# Altium project Stabilizer_Pounder.PrjPCB (part 2 of 3)

## Sheet Quad_DDS.SchDoc: Pounder
size 420 x 297 mm; Author: G.Kasprowicz; CompanyName: WUT ISE; DrawnBy: G.Kasprowicz; Organization: WUT ISE; Address1: PW ISE; Address2: Nowowiejska 15/19 00-665 Warsaw; Address3: gkasprow@gmail.com; DocumentNumber: 4; Revision: 2; SheetNumber: 4; SheetTotal: 7; ModifiedBy: -; CheckedDate: -; Title2: Quad DDS & clocking; DivGrp: WUT ISE; Designer: G.Kasprowicz; ModifiedDate: -; ProjectName: Sensor Box
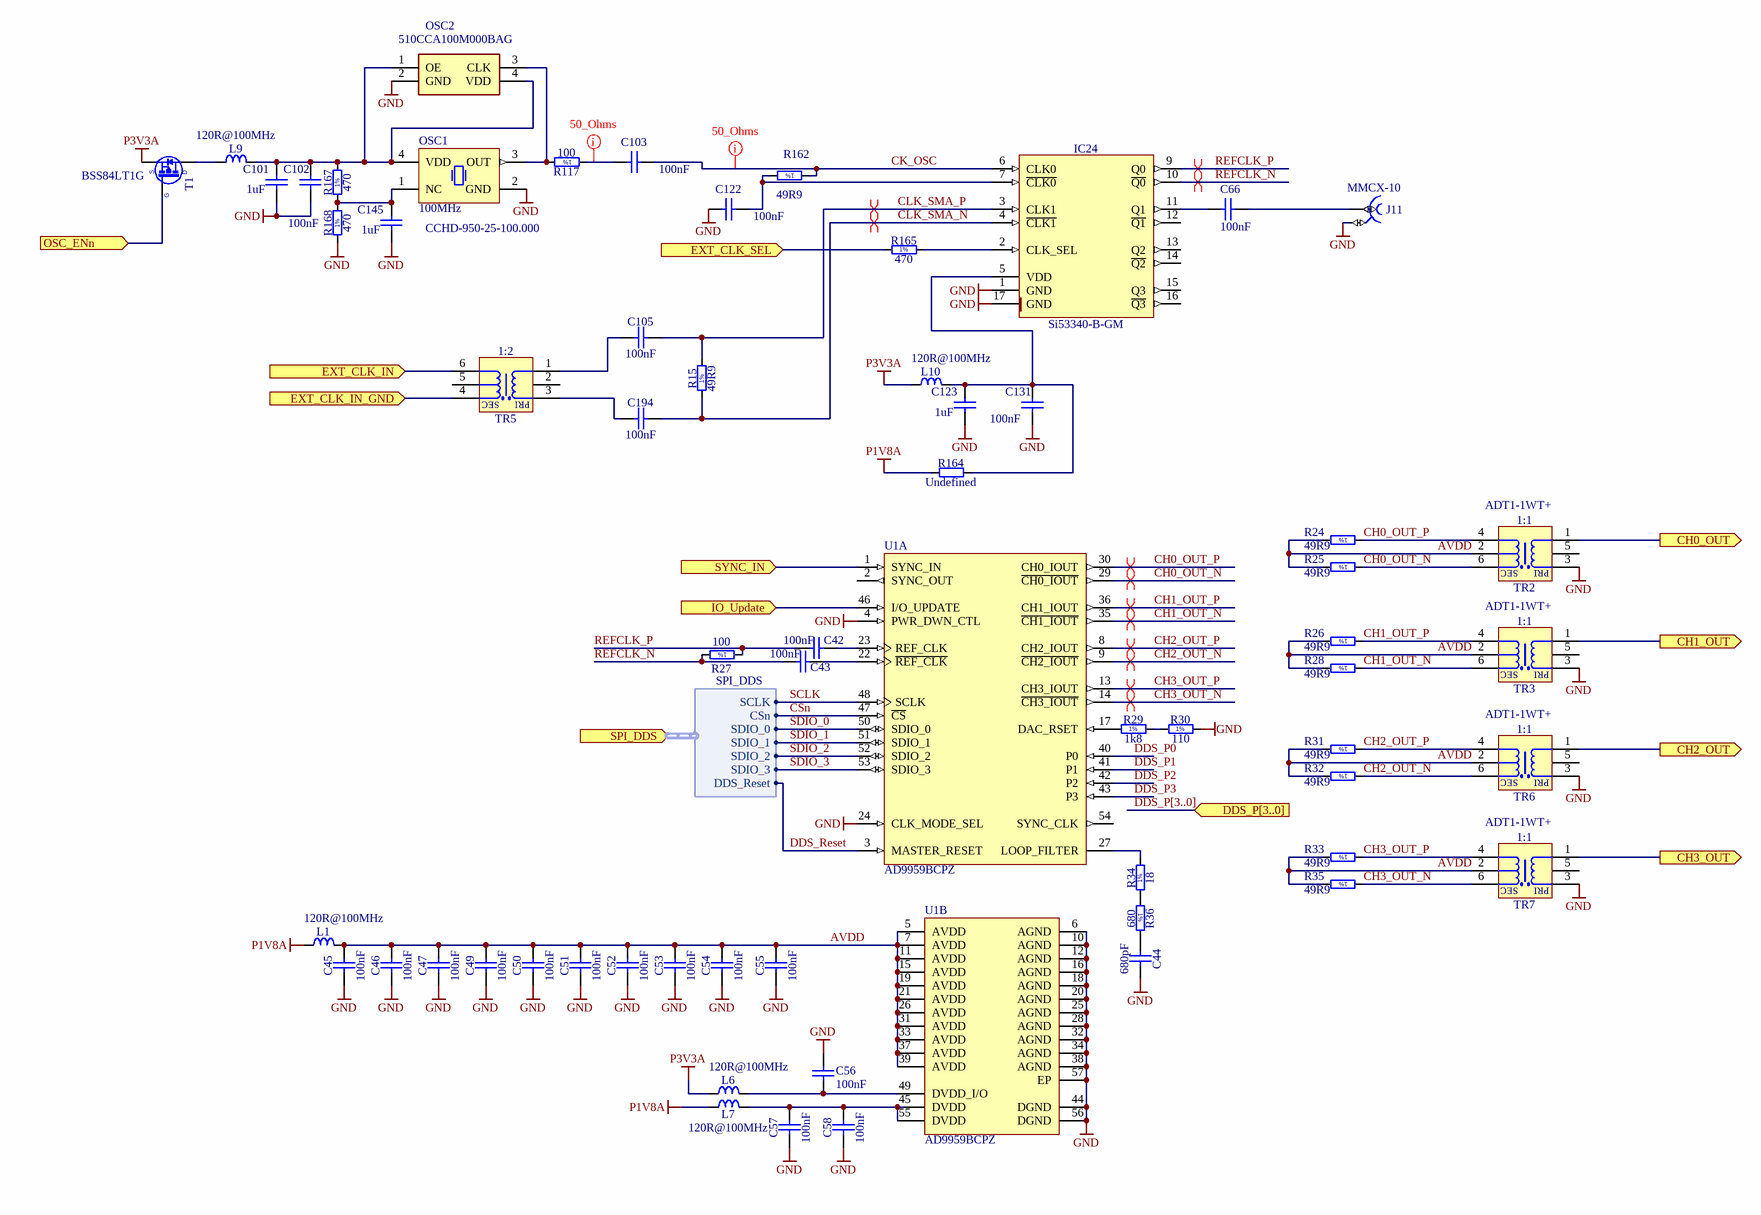
[diagram p3: Quad_DDS.SchDoc]

### Parts
C42  100nF  [CAPC1005X55N]
C43  100nF  [CAPC1005X55N]
C44  680pF  [CAPC1608X87N]
C45  100nF  [CAPC1005X55N]
C46  100nF  [CAPC1005X55N]
C47  100nF  [CAPC1005X55N]
C49  100nF  [CAPC1005X55N]
C50  100nF  [CAPC1005X55N]
C51  100nF  [CAPC1005X55N]
C52  100nF  [CAPC1005X55N]
C53  100nF  [CAPC1005X55N]
C54  100nF  [CAPC1005X55N]
C55  100nF  [CAPC1005X55N]
C56  100nF  [CAPC1005X55N]
C57  100nF  [CAPC1005X55N]
C58  100nF  [CAPC1005X55N]
C66  100nF  [CAPC1005X55N]
C101  1uF  [CAPC1005X55N]
C102  100nF  [CAPC1005X55N]
C103  100nF  [CAPC1005X55N]
C105  100nF  [CAPC1005X55N]
C122  100nF  [CAPC1005X55N]
C123  1uF  [CAPC1005X55N]
C131  100nF  [CAPC1005X55N]
C145  1uF  [CAPC1005X55N]
C194  100nF  [CAPC1005X55N]
IC24  Si53340-B-GM  [QFN50P300X300X90-17N-S175]
J11  Part Number: MMCX-10  [NINIGI_MMCX-10]  (hidden comment: Coax_1Female_1Shield)
L1  120R@100MHz  [INDC1608X95N]
L6  120R@100MHz  [INDC1608X95N]
L7  120R@100MHz  [INDC1608X95N]
L9  120R@100MHz  [INDC1608X95N]
L10  120R@100MHz  [INDC1608X95N]
OSC1  100MHz  Manufacturer Part Number: CCHD-950-25-100.000  [OSC_CRYSTEK_CCHD-950]
OSC2  510CCA100M000BAG  [510CBA49M1520BAG]
R15  49R9  [RESC1005X40N]
R24  49R9  [RESC1005X40N]
R25  49R9  [RESC1005X40N]
R26  49R9  [RESC1005X40N]
R27  100  [RESC1005X40N]
R28  49R9  [RESC1005X40N]
R29  1k8  [RESC1608X55N]
R30  110  [RESC1005X40N]
R31  49R9  [RESC1005X40N]
R32  49R9  [RESC1005X40N]
R33  49R9  [RESC1005X40N]
R34  18  [RESC1005X40N]
R35  49R9  [RESC1005X40N]
R36  680  [RESC1005X40N]
R117  100  [RESC1005X40N]
R162  49R9  [RESC1005X40N]
R164  Undefined  [RESC1608X55N]
R165  470  [RESC1005X40N]
R167  470  [RESC1005X40N]
R168  470  [RESC1005X40N]
T1  BSS84LT1G  [SOT95P240X110-3N]
TR2  1:1  Manufacturer Part Number: ADT1-1WT+  [XFMR_MINI-CIRCUITS_CD542]
TR3  1:1  Manufacturer Part Number: ADT1-1WT+  [XFMR_MINI-CIRCUITS_CD542]
TR5  1:2  [XFMR_MINI-CIRCUITS_CD542]
TR6  1:1  Manufacturer Part Number: ADT1-1WT+  [XFMR_MINI-CIRCUITS_CD542]
TR7  1:1  Manufacturer Part Number: ADT1-1WT+  [XFMR_MINI-CIRCUITS_CD542]
U1  AD9959BCPZ  [ADI-CP-56-1_M]  (parts A,B of 2)

### Ports
CH0_OUT (out), CH1_OUT (out), CH2_OUT (out), CH3_OUT (out), DDS_P[3..0] (in), EXT_CLK_IN (in), EXT_CLK_IN_GND (in), EXT_CLK_SEL (in), IO_Update (in), OSC_ENn (in), SPI_DDS (in, harness SPI_DDS), SYNC_IN (in)

### Harnesses
SPI_DDS: SCLK, CSn, SDIO_0, SDIO_1, SDIO_2, SDIO_3, DDS_Reset

### Nets
GND: C44.2 C45.1 C46.1 C47.1 C49.1 C50.1 C51.1 C52.1 C53.1 C54.1 C55.1 C56.1 C57.1 C58.1 C101.1 C102.1 C122.2 C123.1 C131.1 C145.1 IC24.1(GND) IC24.17(GND) J11.2 OSC1.2(GND) OSC2.2(GND) R30.2 R168.1 TR2.3(PDOT) TR3.3(PDOT) TR6.3(PDOT) TR7.3(PDOT) U1.4(PWR_DWN_CTL) U1.6(AGND) U1.10(AGND) U1.12(AGND) U1.16(AGND) U1.18(AGND) U1.20(AGND) U1.24(CLK_MODE_SEL) U1.25(AGND) U1.28(AGND) U1.32(AGND) U1.34(AGND) U1.38(AGND) U1.44(DGND) U1.56(DGND) U1.57(EP)
P1V8A: L1.2 L7.2 R164.1
P3V3A: L6.2 L10.2 T1.2(S)
AVDD: C45.2 C46.2 C47.2 C49.2 C50.2 C51.2 C52.2 C53.2 C54.2 C55.2 L1.1 R24.2 R25.2 R26.2 R28.2 R31.2 R32.2 R33.2 R35.2 TR2.2(SCT) TR3.2(SCT) TR6.2(SCT) TR7.2(SCT) U1.5(AVDD) U1.7(AVDD) U1.11(AVDD) U1.15(AVDD) U1.19(AVDD) U1.21(AVDD) U1.26(AVDD) U1.31(AVDD) U1.33(AVDD) U1.37(AVDD) U1.39(AVDD)
CH0_OUT_N: R25.1 TR2.6(SDOT) U1.29(~{CH0_IOUT})
CH0_OUT_P: R24.1 TR2.4(S) U1.30(CH0_IOUT)
CH1_OUT_N: R28.1 TR3.6(SDOT) U1.35(~{CH1_IOUT})
CH1_OUT_P: R26.1 TR3.4(S) U1.36(CH1_IOUT)
CH2_OUT_N: R32.1 TR6.6(SDOT) U1.9(~{CH2_IOUT})
CH2_OUT_P: R31.1 TR6.4(S) U1.8(CH2_IOUT)
CH3_OUT_N: R35.1 TR7.6(SDOT) U1.14(~{CH3_IOUT})
CH3_OUT_P: R33.1 TR7.4(S) U1.13(CH3_IOUT)
CK_OSC: C103.1 IC24.6(CLK0) R162.1
CLK_SMA_N: C194.2 IC24.4(~{CLK1}) R15.1
CLK_SMA_P: C105.2 IC24.3(CLK1) R15.2
CSn: U1.47(~{CS}) ; port SPI_DDS.CSn
DDS_P0: U1.40(P0)
DDS_P1: U1.41(P1)
DDS_P2: U1.42(P2)
DDS_P3: U1.43(P3)
DDS_Reset: U1.3(MASTER_RESET) ; port SPI_DDS.DDS_Reset
EXT_CLK_SEL: R165.1 ; port EXT_CLK_SEL
IO_Update: U1.46(I/O_UPDATE) ; port IO_Update
OSC_ENn: T1.1(G) ; port OSC_ENn
REFCLK_N: C43.2 IC24.10(~{Q0}) R27.2
REFCLK_P: C42.2 IC24.9(Q0) R27.1
SCLK: U1.48(SCLK) ; port SPI_DDS.SCLK
SDIO_0: U1.50(SDIO_0) ; port SPI_DDS.SDIO_0
SDIO_1: U1.51(SDIO_1) ; port SPI_DDS.SDIO_1
SDIO_2: U1.52(SDIO_2) ; port SPI_DDS.SDIO_2
SDIO_3: U1.53(SDIO_3) ; port SPI_DDS.SDIO_3
SYNC_IN: U1.1(SYNC_IN) ; port SYNC_IN
NetC42_1: C42.1 U1.23(REF_CLK)
NetC43_1: C43.1 U1.22(~{REF_CLK})
NetC44_1: C44.1 R36.2
NetC56_2: C56.2 L6.1 U1.49(DVDD_I/O)
NetC57_2: C57.2 C58.2 L7.1 U1.45(DVDD) U1.55(DVDD)
NetC66_1: C66.1 J11.1
NetC66_2: C66.2 IC24.11(Q1)
NetC101_2: C101.2 C102.2 L9.1 OSC1.4(VDD) OSC2.1(OE) OSC2.4(VDD) R167.2
NetC103_2: C103.2 R117.1
NetC105_1: C105.1 TR5.1(P)
NetC122_1: C122.1 IC24.7(~{CLK0}) R162.2
NetC123_2: C123.2 C131.2 IC24.5(VDD) L10.1 R164.2
NetC145_2: C145.2 OSC1.1(NC) R167.1 R168.2
NetC194_1: C194.1 TR5.3(PDOT)
NetFL2A_1: TR2.1(P) ; port CH0_OUT
NetFL2B_1: TR3.1(P) ; port CH1_OUT
NetFL4A_1: TR6.1(P) ; port CH2_OUT
NetFL4B_1: TR7.1(P) ; port CH3_OUT
NetIC24_2: IC24.2(CLK_SEL) R165.2
NetJ3_1: TR5.6(SDOT) ; port EXT_CLK_IN
NetJ3_2: TR5.4(S) ; port EXT_CLK_IN_GND
NetL9_2: L9.2 T1.3(D)
NetOSC1_3: OSC1.3(OUT) OSC2.3(CLK) R117.2
NetR29_1: R29.1 U1.17(DAC_RSET)
NetR29_2: R29.2 R30.1
NetR34_1: R34.1 R36.1
NetR34_2: R34.2 U1.27(LOOP_FILTER)

Not connected (* = marked no-connect by the designer): IC24 12(~{Q1}) 13(Q2) 14(~{Q2}) 15(Q3) 16(~{Q3}); TR2 5(NC); TR3 5(NC); TR5 2(NC) 5(SCT); TR6 5(NC); TR7 5(NC); U1 2(SYNC_OUT) 54(SYNC_CLK)

### Buses and harness runs
bus DDS_P[3..0] = port DDS_P[3..0]

### Layout directives
net class 50_Ohms: CK_OSC, NetC103_2
differential pair: CH0_OUT_N, CH0_OUT_P, CH1_OUT_N, CH1_OUT_P, CH2_OUT_N, CH2_OUT_P, CH3_OUT_N, CH3_OUT_P, CLK_SMA_N, CLK_SMA_P, REFCLK_N, REFCLK_P

### Notes on the sheet
- Project/Equipment
- Document
- Designer
- Drawn by
- Check.by
- Copyright WUT ISE 2018.
  This documentation describes Open Hardware and is licensed under the CERN OHL v.1.1. You may redistribute and modify this documentation under the terms of the CERN OHL v.1.1. (http://ohwr.org/CERNOHL). This documentation is distributed WITHOUT ANY EXPRESS OR IMPLIED WARRANTY, INCLUDING OF MERCHANTABILITY, SATISFACTORY QUALITY AND FITNESS FOR A PARTICULAR PURPOSE. Please see the CERN OHL v.1.1 for applicable conditions.
- Contact
- File
- Last Mod.
- Print Date
- Sheet
- Size
- A3
- of
- Rev
- (in symbol R0402_18R_1%_0.0625W_100PPM) 1%
- (in symbol R0402_49R9_1%_0.0625W_100PPM) 1%
- (in symbol R0402_100R_1%_0.0625W_100PPM) 1%
- (in symbol R0402_110R_1%_0.0625W_100PPM) 1%
- (in symbol R0402_470R_1%_0.0625W_100PPM) 1%
- (in symbol R0402_680R_1%_0.0625W_100PPM) 1%
- (in symbol R0603_1K8_1%_0.1W_100PPM) 1%
- (in symbol XFMR_MINI-CIRCUITS_ADT1-1WT+) SEC; PRI
- (in symbol XFMR_MINI-CIRCUITS_ADT2-1T-1P+) SEC; PRI

### Library data of the parts
C42 C43 C45-C47 C49-C58 C66 C102 C103 C105 C122 C131 C194 = CC0402_100NF_16V_10%_X5R: Non-polarised capacitor; Part Description: SMD Multilayer Chip Ceramic Capacitor; Manufacturer: GENERIC; Manufacturer1 Part Number: GRM155R61C104KA88D; Voltage: 16V; TC: X5R; Tolerance: ±10%; Part Number: CC0402_100NF_16V_10%_X5R; Component Kind: Standard; Component Type: Standard; Pin Count: 2; Value: 100nF; Status: None; Manufacturer Part Number: CC0402_100NF_16V_10%_X5R; Case: 0402; Mounted: Yes; Socket: No; SMD: Yes; Sense: No; Manufacturer1 Example: MURATA; Manufacturer1 ComponentHeight: 0.55mm; HelpURL: \\cern.ch\dfs\Applications\Altium\Datasheets\CC0402_X5R_MURATA_GRM.pdf; Author: CERN DEM JLC; CreateDate: 10.12.2013; LatestRevisionDate: 10.12.2013
C44 = CC0603_680PF_50V_5%_NP0: Non-polarised capacitor; Part Description: SMD Multilayer Chip Ceramic Capacitor; Manufacturer: GENERIC; Manufacturer1 Part Number: 223886715681; Voltage: 50V; TC: C0G/NP0; Tolerance: ±5%; Part Number: CC0603_680PF_50V_5%_NP0; Component Kind: Standard; Component Type: Standard; Pin Count: 2; Value: 680pF; Status: Preferred; Manufacturer Part Number: CC0603_680PF_50V_5%_NP0; Case: 0603; Mounted: Yes; Socket: No; SMD: Yes; Sense: No; Manufacturer1 Example: PHYCOMP; Manufacturer1 ComponentHeight: 0.87mm; HelpURL: \\cern.ch\dfs\Applications\Altium\Datasheets\CC0603_NP0_PHYCOMP.pdf; Author: CERN DEM JLC; CreateDate: 03.12.2007; LatestRevisionDate: 03.12.2007
C101 C123 C145 = CC0402_1UF_16V_10%_X5R: Non-polarised capacitor; Part Description: SMD Multilayer Chip Ceramic Capacitor; Manufacturer: GENERIC; Manufacturer1 Part Number: C1005X5R1C105KT; Voltage: 16V; TC: X5R; Tolerance: ±10%; Part Number: CC0402_1UF_16V_10%_X5R; Component Kind: Standard; Component Type: Standard; Pin Count: 2; Value: 1uF; Status: Preferred; Manufacturer Part Number: CC0402_1UF_16V_10%_X5R; Case: 0402; Mounted: Yes; Socket: No; SMD: Yes; Sense: No; Manufacturer1 Example: TDK; Manufacturer1 ComponentHeight: 0.55mm; HelpURL: \\cern.ch\dfs\Applications\Altium\Datasheets\CC0402_X5R_TDK_C.pdf; Author: CERN DEM JLC; CreateDate: 2012-10-25; LatestRevisionDate: 2012-10-25
IC24 = Si53340-B-GM: Low-Jitter LVDS Fanout Clock Buffers, 10-Output,  Any-Input, Any-Frequency up to 1250MHz; Manufacturer: SILICON LABS; PressFit: No; Bonding: No; Part Number: Si53340-B-GM; Component Kind: Standard; Component Type: Standard; Device: Si53340-B-GM; PackageDescription: QFN, 0.50mm Pitch, Square; 16 Pin, 3.00mm L X 3.00mm W X 0.90mm H Body (w/thermal tab 1.75mm x 1.75mm), IPC Medium Density; Part Description: Low-Jitter LVDS Fanout Clock Buffers, 10-Output,  Any-Input, Any-Frequency up to 1250MHz; Manufacturer Part Number: Si53340-B-GM; Pin Count: 17; Case: QFN16; Mounted: Yes; Socket: No; SMD: Yes; Sense: No; ComponentHeight: 0.9mm; HelpURL: \\cern.ch\dfs\Applications\Altium\Datasheets\Si53340-B-GM.pdf; Author: CERN DEM MR; CreateDate: 04.09.2017; LatestRevisionDate: 04.09.2017
J11 = CON_RF_MMCX: Part Description: Straight Through-hole 50 Ohm Micro Mini RF Jack, MMCX Series; Manufacturer: NINIGI; Manufacturer Part Number: NINIGI MMCX-10; PressFit: No; Component Kind: Standard; Component Type: Standard; Pin Count: 2; Mounted: Yes; Socket: No; Sense: No; SMD: No; Status: None; ComponentHeight: 4.35mm; HelpURL: \\cern.ch\dfs\Applications\Altium\Datasheets\SAMTEC_MMCX-J-P-H-ST-TH1.pdf; Author: GK; CreateDate: 05.12.2012; LatestRevisionDate: 05.12.2012
L1 L6 L7 L9 L10 = IND0603_MURATA_BLM18PG121SN1D: Inductor; Part Description: SMD EMIFIL Chip Ferrite Bead; Manufacturer: MURATA; Power: 2A; Resistance: 0.05R; Part Number: IND0603_MURATA_BLM18PG121SN1D; Component Kind: Standard; Component Type: Standard; Pin Count: 2; Value: 120R@100MHz; Status: None; Manufacturer Part Number: BLM18PG121SN1D; Case: 0603; Mounted: Yes; Socket: No; SMD: Yes; Sense: No; ComponentHeight: 0.95mm; HelpURL: \\cern.ch\dfs\Applications\Altium\Datasheets\IND0603_MURATA_BLM18P.pdf; Author: CERN DEM BC; CreateDate: 2015-07-27; LatestRevisionDate: 2015-07-27
OSC1 = OSC_CCHD-950: 100MHz low noise oscillator; Part Number: OSC_100MHZ_CRYSTEK_CCHD-950-25-100.000; Part Description: 3.3V, ±25ppm, 0..70°C, CMOS Surface Mount Ultra-Low Noise Oscillator (CCHD-950 Series); Manufacturer: CRYSTEK CRYSTAL; PressFit: No; Bonding: No; Component Kind: Standard; Component Type: Standard; PackageDescription: Oscillator, 5.08mm Pitch; 4 Pin, 14.2mm L X 9.14mm W X 5.3mm H, CCHD-950 Serie; Value: 100MHz; Pin Count: 4; Mounted: Yes; Socket: No; SMD: Yes; Sense: No; ComponentHeight: 5.3mm; HelpURL: \\cern.ch\dfs\Applications\Altium\Datasheets\OSC_CRYSTEK_CVHD-950.pdf; Author: GK; CreateDate: 04.11.2016; LatestRevisionDate: 04.11.2016
OSC2 = 510CCA100M000BAG: Crystal or Oscillator; Manufacturer_Name: Silicon Labs; Datasheet Link: https://www.silabs.com/documents/public/data-sheets/si510-11.pdf; Height: 1mm; Manufacturer_Part_Number: 510CCA100M000BAG; Mouser Part Number: 634-510CCA100M000BAG; Mouser Price/Stock: https://www.mouser.com/Search/Refine.aspx?Keyword=634-510CCA100M000BAG
R15 R24-R26 R28 R31-R33 R35 R162 = R0402_49R9_1%_0.0625W_100PPM: Resistor - 1%; Part Description: General Purpose Thick Film Chip Resistor; Manufacturer: GENERIC; Manufacturer1 Part Number: 232270674999L or RC0402FR-0749R9L; TC: ±100ppm/°C; PressFit: No; Part Number: R0402_49R9_1%_0.0625W_100PPM; Component Kind: Standard; Component Type: Standard; Pin Count: 2; Value: 49R9; Status: Not Recommended; Power: 0.0625W; Tolerance: ±1%; Manufacturer Part Number: R0402_49R9_1%_0.0625W_100PPM; Case: 0402; Mounted: Yes; Sense: No; Socket: No; SMD: Yes; Manufacturer1 Example: YAGEO PHYCOMP; Manufacturer1 ComponentHeight: 0.4mm; HelpURL: \\cern.ch\dfs\Applications\Altium\Datasheets\R0402_Phycomp_RC0402.pdf; Author: CERN DEM JLC; CreateDate: 24.10.2012; LatestRevisionDate: 24.10.2012
R27 R117 = R0402_100R_1%_0.0625W_100PPM: Resistor - 1%; Part Description: General Purpose Thick Film Chip Resistor; Manufacturer: GENERIC; Manufacturer1 Part Number: 232270671001L; TC: ±100ppm/°C; PressFit: No; Part Number: R0402_100R_1%_0.0625W_100PPM; Component Kind: Standard; Component Type: Standard; Pin Count: 2; Value: 100; Status: Not Recommended; Power: 0.0625W; Tolerance: ±1%; Manufacturer Part Number: R0402_100R_1%_0.0625W_100PPM; Case: 0402; Mounted: Yes; Sense: No; Socket: No; SMD: Yes; Manufacturer1 Example: YAGEO PHYCOMP; Manufacturer1 ComponentHeight: 0.4mm; HelpURL: \\cern.ch\dfs\Applications\Altium\Datasheets\R0402_Phycomp_RC0402.pdf; Author: CERN DEM JLC; CreateDate: 03.12.2007; LatestRevisionDate: 17.10.2012
R29 = R0603_1K8_1%_0.1W_100PPM: Resistor - 1%; Part Description: General Purpose Thick Film Chip Resistor; Manufacturer: GENERIC; Manufacturer1 Part Number: NRC06F1801TRF; Power: 0.1W; TC: ±100ppm/°C; PressFit: No; Part Number: R0603_1K8_1%_0.1W_100PPM; Component Kind: Standard; Component Type: Standard; Pin Count: 2; Value: 1k8; Status: Preferred; Tolerance: ±1%; Manufacturer Part Number: R0603_1K8_1%_0.1W_100PPM; Case: 0603; Mounted: Yes; Sense: No; Socket: No; SMD: Yes; Manufacturer1 Example: NIC COMPONENT; Manufacturer1 ComponentHeight: 0.55mm; HelpURL: \\cern.ch\dfs\Applications\Altium\Datasheets\R0603_NIC_NRC.pdf; Author: CERN DEM JLC; CreateDate: 03.12.2007; LatestRevisionDate: 13.03.2008
R30 = R0402_110R_1%_0.0625W_100PPM: Resistor - 1%; Part Description: General Purpose Thick Film Chip Resistor; Manufacturer: GENERIC; Manufacturer1 Part Number: 232270671101L; TC: ±100ppm/°C; PressFit: No; Part Number: R0402_110R_1%_0.0625W_100PPM; Component Kind: Standard; Component Type: Standard; Pin Count: 2; Value: 110; Status: Not Recommended; Power: 0.0625W; Tolerance: ±1%; Manufacturer Part Number: R0402_110R_1%_0.0625W_100PPM; Case: 0402; Mounted: Yes; Sense: No; Socket: No; SMD: Yes; Manufacturer1 Example: YAGEO PHYCOMP; Manufacturer1 ComponentHeight: 0.4mm; HelpURL: \\cern.ch\dfs\Applications\Altium\Datasheets\R0402_Phycomp_RC0402.pdf; Author: CERN DEM JLC; CreateDate: 03.12.2007; LatestRevisionDate: 17.10.2012
R34 = R0402_18R_1%_0.0625W_100PPM: Resistor - 1%; Part Description: General Purpose Thick Film Chip Resistor; Manufacturer: GENERIC; Manufacturer1 Part Number: 232270671809L; TC: ±100ppm/°C; PressFit: No; Part Number: R0402_18R_1%_0.0625W_100PPM; Component Kind: Standard; Component Type: Standard; Pin Count: 2; Value: 18; Status: Not Recommended; Power: 0.0625W; Tolerance: ±1%; Manufacturer Part Number: R0402_18R_1%_0.0625W_100PPM; Case: 0402; Mounted: Yes; Sense: No; Socket: No; SMD: Yes; Manufacturer1 Example: YAGEO PHYCOMP; Manufacturer1 ComponentHeight: 0.4mm; HelpURL: \\cern.ch\dfs\Applications\Altium\Datasheets\R0402_Phycomp_RC0402.pdf; Author: CERN DEM JLC; CreateDate: 03.12.2007; LatestRevisionDate: 17.10.2012
R36 = R0402_680R_1%_0.0625W_100PPM: Resistor - 1%; Part Description: General Purpose Thick Film Chip Resistor; Manufacturer: GENERIC; Manufacturer1 Part Number: 232270676801L; TC: ±100ppm/°C; PressFit: No; Part Number: R0402_680R_1%_0.0625W_100PPM; Component Kind: Standard; Component Type: Standard; Pin Count: 2; Value: 680; Status: Not Recommended; Power: 0.0625W; Tolerance: ±1%; Manufacturer Part Number: R0402_680R_1%_0.0625W_100PPM; Case: 0402; Mounted: Yes; Sense: No; Socket: No; SMD: Yes; Manufacturer1 Example: YAGEO PHYCOMP; Manufacturer1 ComponentHeight: 0.4mm; HelpURL: \\cern.ch\dfs\Applications\Altium\Datasheets\R0402_Phycomp_RC0402.pdf; Author: CERN DEM JLC; CreateDate: 03.12.2007; LatestRevisionDate: 17.10.2012
R164 = R0603_NO-VALUE: Resistor; Part Description: Reserved Footprint For a 0603 (1608) Chip Resistor; PressFit: No; Mounted: No; Part Number: R0603_NO-VALUE; Component Kind: Standard; Component Type: Standard; Pin Count: 2; Value: Undefined; Status: None; Manufacturer: Undefined; Manufacturer Part Number: R0603_NO-VALUE; Case: 0603; Sense: No; Socket: No; SMD: Yes; Manufacturer1 Example: Undefined; Manufacturer1 Part Number: Undefined; Manufacturer1 ComponentHeight: Undefined; HelpURL: Undefined; Author: CERN DEM JLC; CreateDate: 03.12.2007; LatestRevisionDate: 13.03.2008
R165 R167 R168 = R0402_470R_1%_0.0625W_100PPM: Resistor - 1%; Part Description: General Purpose Thick Film Chip Resistor; Manufacturer: GENERIC; Manufacturer1 Part Number: 232270674701L; TC: ±100ppm/°C; PressFit: No; Part Number: R0402_470R_1%_0.0625W_100PPM; Component Kind: Standard; Component Type: Standard; Pin Count: 2; Value: 470; Status: Not Recommended; Power: 0.0625W; Tolerance: ±1%; Manufacturer Part Number: R0402_470R_1%_0.0625W_100PPM; Case: 0402; Mounted: Yes; Sense: No; Socket: No; SMD: Yes; Manufacturer1 Example: YAGEO PHYCOMP; Manufacturer1 ComponentHeight: 0.4mm; HelpURL: \\cern.ch\dfs\Applications\Altium\Datasheets\R0402_Phycomp_RC0402.pdf; Author: CERN DEM JLC; CreateDate: 03.12.2007; LatestRevisionDate: 17.10.2012
T1 = BSS84LT1G: P-CHANNEL MOSFET WITH DIODE; Part Description: 50V 130mA Single P-Channel Power MOSFET; Manufacturer: ON SEMICONDUCTOR; PressFit: No; Bonding: No; Part Number: BSS84LT1G; Component Kind: Standard; Component Type: Standard; Device: BSS84LT1G; PackageDescription: SOT23 3-Leads, Pitch 0.95mm - Body 1.4x3mm, IPC Medium Density; Manufacturer Part Number: BSS84LT1G; Pin Count: 3; Case: SOT23-3; Mounted: Yes; Socket: No; SMD: Yes; Sense: No; ComponentHeight: 1.1mm; HelpURL: \\cern.ch\dfs\Applications\Altium\Datasheets\BSS84LT1G.pdf; Author: CERN DEM JLC; CreateDate: 29.03.2012; LatestRevisionDate: 29.03.2012
TR2 TR3 TR6 TR7 = XFMR_MINI-CIRCUITS_ADT1-1WT+: 75 Ohm 0.4 To 800MHz RF Transformers; Part Description: 75 Ohms 0.4 to 800 MHz RF Transformer; Part Number: XFMR_MINI-CIRCUITS_ADT1-1WT+; Component Kind: Standard; Component Type: Standard; Pin Count: 6; Value: 1:1; Status: None; Manufacturer: MINI-CIRCUITS; Mounted: Yes; Socket: No; Sense: No; SMD: Yes; ComponentHeight: 2.84mm; HelpURL: \\cern.ch\dfs\Applications\Altium\Datasheets\XFMR_MINI-CIRCUITS_ADT1-1WT+.pdf; Author: CERN DEM JLC; CreateDate: 21.09.2011; LatestRevisionDate: 21.09.2011
TR5 = XFMR_MINI-CIRCUITS_ADT2-1T-1P+: 50 Ohms 0.4 To 450MHz RF Transformer; Part Number: XFMR_MINI-CIRCUITS_ADT2-1T+; Manufacturer Part Number: ADT2-1T+; Component Kind: Standard; Component Type: Standard; Pin Count: 6; Value: 1:2; Status: None; Part Description: 50 Ohms 0.4 To 450MHz RF Transformer; Manufacturer: MINI-CIRCUITS; Mounted: Yes; Socket: No; Sense: No; SMD: Yes; ComponentHeight: 2.84mm; HelpURL: \\cern.ch\dfs\Applications\Altium\Datasheets\XFMR_MINI-CIRCUITS_ADT2-1T-1P+.pdf; Author: CERN DEM MR; CreateDate: 06.09.2017; LatestRevisionDate: 06.09.2017
U1 = CMP-0293-00014-1: 4-Channel, 500 MSPS DDS with 10-Bit DACs, Serial, CP-56-1, 260 Tray, Pb-Free; Tuning Word Width (bits): 32bit; Master fclk: 500MHz; Compliance Range (V): 2.3V; FS Iout (mA nom): 10mA; REFCLK Multiplier: Yes; I Supply total (max): 180mA; Resolution (Bits): 10bit; ComponentLink3URL: http://www.analog.com/static/imported-files/packages/32698137492825CP_56_1.pdf; PackageDescription: 56-Lead Lead Frame Chip Scale Package [LFCSP_VQ]; DatasheetVersion: Rev. B; ComponentLink1URL: www.analog.com; PackageVersion: 112805-0; ComponentLink1Description: Manufacturer URL; ComponentLink2Description: Datasheet; Code_JEDEC: MO-220-VLLD-2; ComponentLink2URL: http://www.analog.com/static/imported-files/data_sheets/AD9959.pdf; PackageReference: CP-56-1; I/O Interface: Serial; ComponentLink3Description: Package Specification

## Sheet Digital_Attenuator_Amp.SchDoc: Pounder
size 420 x 297 mm; Author: G.Kasprowicz; CompanyName: WUT ISE; DrawnBy: G.Kasprowicz; Organization: WUT ISE; Address1: PW ISE; Address2: Nowowiejska 15/19 00-665 Warsaw; Address3: gkasprow@gmail.com; DocumentNumber: 3; Revision: 2; SheetNumber: 3; SheetTotal: 7; ModifiedBy: -; CheckedDate: -; Title2: Attenuator & Power amplifier; DivGrp: WUT ISE; Designer: G.Kasprowicz; ModifiedDate: -; ProjectName: Sensor Box
Used 2 times, as channels Digital_Attenuator_Amp, Digital_Attenuator_Amp. Parts and nets are listed once, with the designators drawn on the sheet.
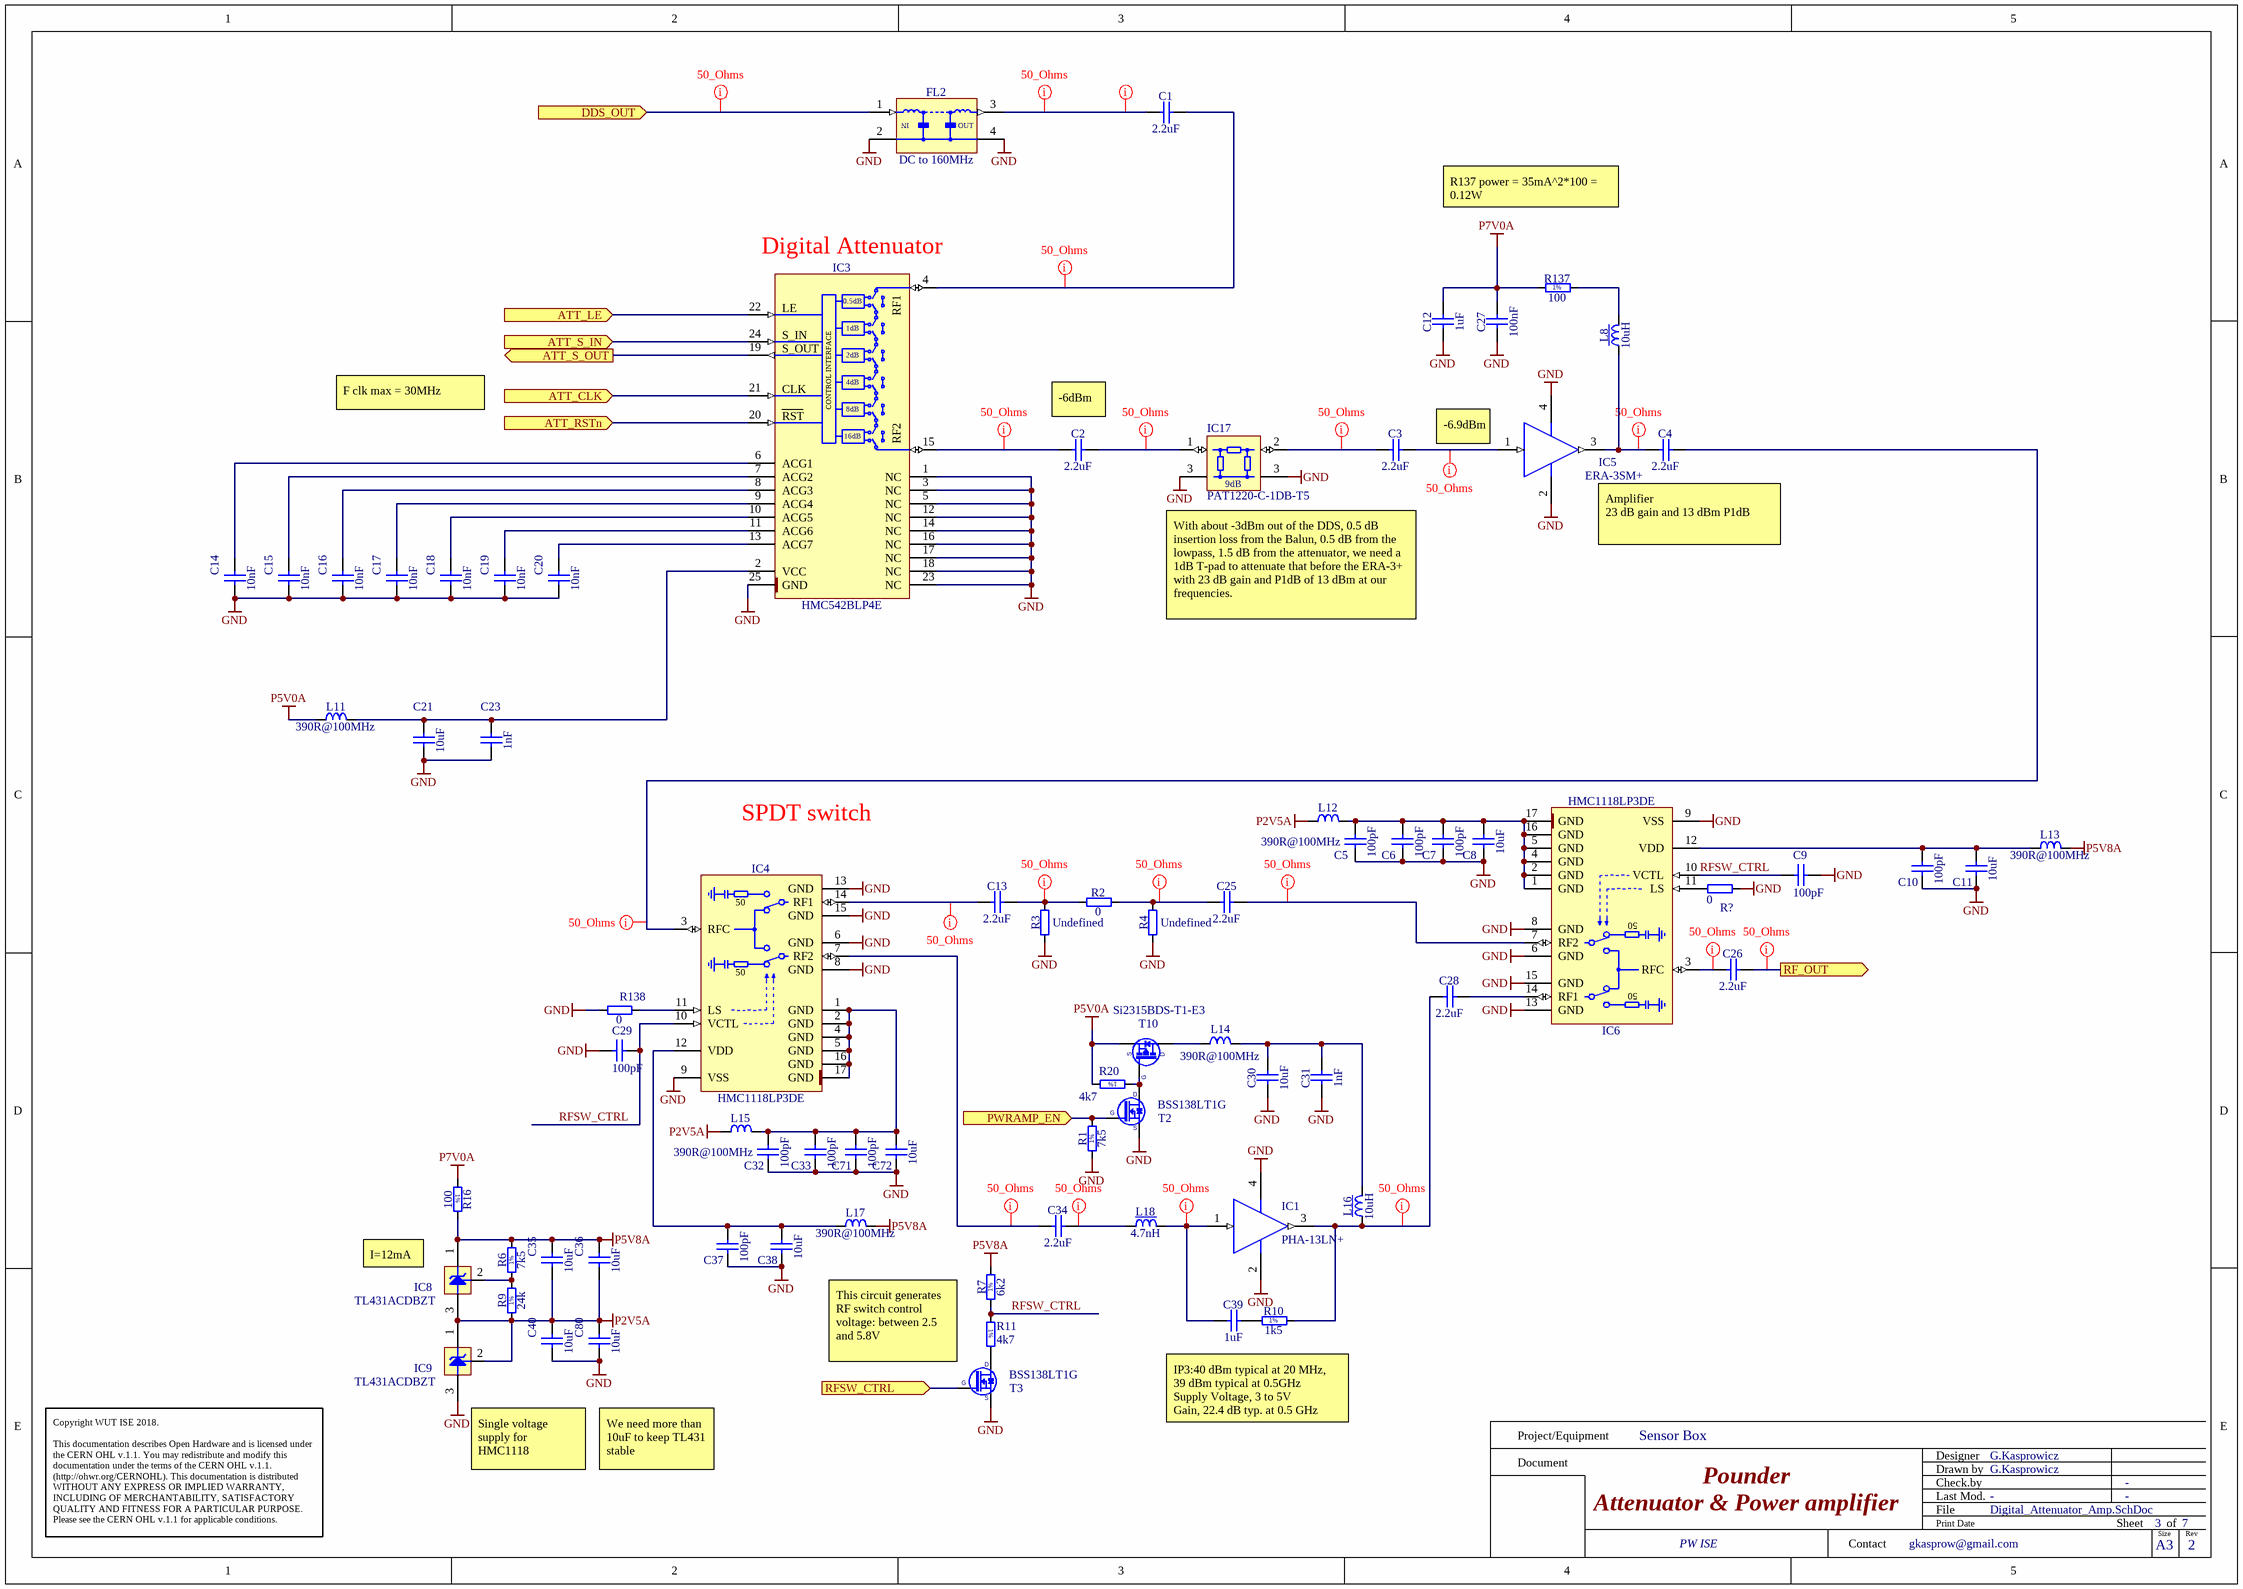
[diagram p4: Digital_Attenuator_Amp.SchDoc]

### Parts
C1  2.2uF  [CAPC1005X55N]
C2  2.2uF  [CAPC1005X55N]
C3  2.2uF  [CAPC1005X55N]
C4  2.2uF  [CAPC1005X55N]
C5  100pF  [CAPC1005X55N]
C6  100pF  [CAPC1005X55N]
C7  100pF  [CAPC1005X55N]
C8  10uF  [CAPC1608X80N]
C9  100pF  [CAPC1005X55N]
C10  100pF  [CAPC1005X55N]
C11  10uF  [CAPC1608X80N]
C12  1uF  [CAPC2012X140N]
C13  2.2uF  [CAPC1005X55N]
C14  10nF  [CAPC1005X55N]
C15  10nF  [CAPC1005X55N]
C16  10nF  [CAPC1005X55N]
C17  10nF  [CAPC1005X55N]
C18  10nF  [CAPC1005X55N]
C19  10nF  [CAPC1005X55N]
C20  10nF  [CAPC1005X55N]
C21  10uF  [CAPC1608X80N]
C23  1nF  [CAPC1005X55N]
C25  2.2uF  [CAPC1005X55N]
C26  2.2uF  [CAPC1005X55N]
C27  100nF  [CAPC1005X55N]
C28  2.2uF  [CAPC1005X55N]
C29  100pF  [CAPC1005X55N]
C30  10uF  [CAPC2012X135N]
C31  1nF  [CAPC1005X55N]
C32  100pF  [CAPC1005X55N]
C33  100pF  [CAPC1005X55N]
C34  2.2uF  [CAPC1005X55N]
C35  10uF  [CAPC1608X80N]
C36  10uF  [CAPC1608X80N]
C37  100pF  [CAPC1005X55N]
C38  10uF  [CAPC1608X80N]
C39  1uF  [CAPC1005X55N]
C40  10uF  [CAPC1608X80N]
C71  100pF  [CAPC1005X55N]
C72  10uF  [CAPC1608X80N]
C80  10uF  [CAPC1608X80N]
FL2  DC to 160MHz  [FIL_MINI-CIRCUITS_FV1206]
IC1  PHA-13LN+  [MINI-CIRCUITS_DF782]
IC3  HMC542BLP4E  [QFN50P400X400X100-25N-S295]
IC4  HMC1118LP3DE  [QFN50P300X300X95-17N-S190]
IC5  ERA-3SM+  [MINI-CIRCUITS_WW107]
IC6  HMC1118LP3DE  [QFN50P300X300X95-17N-S190]
IC8  TL431ACDBZT  [SOT95P237X112-3N]
IC9  TL431ACDBZT  [SOT95P237X112-3N]
IC17  PAT1220-C-1DB-T5  [SUSUMU_PAT1220]
L8  10uH  [IND_MURATA_LQH32C]
L11  390R@100MHz  [INDC1608X95N]
L12  390R@100MHz  [INDC1608X95N]
L13  390R@100MHz  [INDC1608X95N]
L14  390R@100MHz  [INDC1608X95N]
L15  390R@100MHz  [INDC1608X95N]
L16  10uH  [IND_MURATA_LQH32C]
L17  390R@100MHz  [INDC1608X95N]
L18  4.7nH  [IND_MURATA_LQW18AN_G8]
R1  7k5  [RESC1005X40N]
R2  0  [RESC1005X40N]
R3  Undefined  [RESC1005X40N]
R4  Undefined  [RESC1005X40N]
R6  7k5  [RESC1005X40N]
R7  6k2  [RESC1005X40N]
R9  24k  [RESC1005X40N]
R10  1k5  [RESC1005X40N]
R11  4k7  [RESC1005X40N]
R16  100  [RESC1005X40N]
R20  4k7  [RESC1005X40N]
R137  100  [RESC3216X65N]
R138  0  [RESC1005X40N]
R?  0  [RESC1005X40N]
T2  BSS138LT1G  [SOT95P240X110-3N]
T3  BSS138LT1G  [SOT95P240X110-3N]
T10  Si2315BDS-T1-E3  [SOT95P237X112-3N]

### Ports
ATT_CLK (in), ATT_LE (in), ATT_RSTn (in), ATT_S_IN (in), ATT_S_OUT (out), DDS_OUT (in), PWRAMP_EN (in), RF_OUT (out), RFSW_CTRL (in)

### Nets
GND: C5.2 C6.2 C7.2 C8.1 C9.1 C10.2 C11.1 C12.1 C14.1 C15.1 C16.1 C17.1 C18.1 C19.1 C20.1 C21.1 C23.1 C27.1 C29.1 C30.1 C31.1 C32.2 C33.2 C37.2 C38.1 C40.1 C71.2 C72.1 C80.1 FL2.2(GND) FL2.4(GND) IC1.2(GND) IC1.4(GND) IC3.1(NC) IC3.3(NC) IC3.5(NC) IC3.12(NC) IC3.14(NC) IC3.16(NC) IC3.17(NC) IC3.18(NC) IC3.23(NC) IC3.25(GND) IC4.6(GND) IC4.8(GND) IC4.9(VSS) IC4.13(GND) IC4.15(GND) IC5.2(GND) IC5.4(GND) IC6.6(GND) IC6.8(GND) IC6.9(VSS) IC6.13(GND) IC6.15(GND) IC9.3(A) IC17.3(GND) R1.1 R3.1 R4.1 R138.1 R?.1 T2.2(S) T3.2(S)
P2V5A: C35.1 C36.1 C40.2 C80.2 IC8.3(A) IC9.1(C) IC9.2(Adj) L12.1 L15.1 R9.1
P5V0A: L11.1 R20.2 T10.2(S)
P5V8A: C35.2 C36.2 IC8.1(C) L13.2 L17.2 R6.2 R7.2 R16.2
P7V0A: C12.2 C27.2 R16.1 R137.1
ATT_CLK: IC3.21(SHIFT_CLOCK) ; port ATT_CLK
ATT_LE: IC3.22(LATCH_ENABLE) ; port ATT_LE
ATT_RSTn: IC3.20(~{RESET}) ; port ATT_RSTn
ATT_S_IN: IC3.24(SERIAL_INPUT) ; port ATT_S_IN
ATT_S_OUT: IC3.19(SERIAL_OUTPUT) ; port ATT_S_OUT
DDS_OUT: FL2.1(RFIN) ; port DDS_OUT
PWRAMP_EN: R1.2 T2.1(G) ; port PWRAMP_EN
RF_OUT: C26.2 ; port RF_OUT
RFSW_CTRL: C9.2 C29.2 IC4.10(VCTL) IC6.10(VCTL) R7.1 R11.1
RFSW_CTRL: T3.1(G) ; port RFSW_CTRL  [a separate net that carries the same name]
NetC1_1: C1.1 FL2.3(RFOUT)
NetC1_2: C1.2 IC3.4(RF1)
NetC2_1: C2.1 IC3.15(RF2)
NetC2_2: C2.2 IC17.1(IN)
NetC3_1: C3.1 IC17.2(OUT)
NetC3_2: C3.2 IC5.1(RF_IN)
NetC4_1: C4.1 IC5.3(RF_OUT) L8.1
NetC4_2: C4.2 IC4.3(RFC)
NetC5_1: C5.1 C6.1 C7.1 C8.2 IC6.1(GND) IC6.2(GND) IC6.4(GND) IC6.5(GND) IC6.16(GND) IC6.17(GND) L12.2
NetC10_1: C10.1 C11.2 IC6.12(VDD) L13.1
NetC13_1: C13.1 IC4.14(RF1)
NetC13_2: C13.2 R2.1 R3.2
NetC14_2: C14.2 IC3.6(ACG1)
NetC15_2: C15.2 IC3.7(ACG2)
NetC16_2: C16.2 IC3.8(ACG3)
NetC17_2: C17.2 IC3.9(ACG4)
NetC18_2: C18.2 IC3.10(ACG5)
NetC19_2: C19.2 IC3.11(ACG6)
NetC20_2: C20.2 IC3.13(ACG7)
NetC21_2: C21.2 C23.2 IC3.2(VCC) L11.2
NetC25_1: C25.1 R2.2 R4.2
NetC25_2: C25.2 IC6.7(RF2)
NetC26_1: C26.1 IC6.3(RFC)
NetC28_1: C28.1 IC1.3(RF_OUT) L16.1 R10.2
NetC28_2: C28.2 IC6.14(RF1)
NetC30_2: C30.2 C31.2 L14.2 L16.2
NetC32_1: C32.1 C33.1 C71.1 C72.2 IC4.1(GND) IC4.2(GND) IC4.4(GND) IC4.5(GND) IC4.16(GND) IC4.17(GND) L15.2
NetC34_1: C34.1 IC4.7(RF2)
NetC34_2: C34.2 L18.1
NetC37_1: C37.1 C38.2 IC4.12(VDD) L17.1
NetC39_1: C39.1 IC1.1(RF_IN) L18.2
NetC39_2: C39.2 R10.1
NetIC4_11: IC4.11(LS) R138.2
NetIC6_11: IC6.11(LS) R?.2
NetIC8_2: IC8.2(Adj) R6.1 R9.2
NetL8_2: L8.2 R137.2
NetL14_1: L14.1 T10.3(D)
NetR11_2: R11.2 T3.3(D)
NetR20_1: R20.1 T2.3(D) T10.1(G)

### Channels
Digital_Attenuator_Amp: designators end in A; ports ATT_CLK=SPI1_SCK ATT_LE=SPI1_NSS ATT_RSTn=ATT_RSTn ATT_S_IN=SPI1_MOSI ATT_S_OUT=NetIC3A_19 DDS_OUT=NetFL2A_1 PWRAMP_EN=NetR1A_2 RF_OUT=NetC26A_2 RFSW_CTRL=RFSW_CTRL0
Digital_Attenuator_Amp: designators end in B; ports ATT_CLK=SPI1_SCK ATT_LE=SPI1_NSS ATT_RSTn=ATT_RSTn ATT_S_IN=NetIC3A_19 ATT_S_OUT=NetIC3B_19 DDS_OUT=NetFL2B_1 PWRAMP_EN=NetR1B_2 RF_OUT=NetC26B_2 RFSW_CTRL=RFSW_CTRL1

### Layout directives
net class 50_Ohms: NetC1A_1, NetC1A_2, NetC2A_1, NetC2A_2, NetC3A_1, NetC3A_2, NetC4A_1, NetC4A_2, NetC13A_1, NetC13A_2, NetC25A_1, NetC25A_2, NetC26A_1, NetC26A_2, NetC28A_1, NetC34A_1, NetC34A_2, NetC39A_1, NetFL2A_1

### Notes on the sheet
- (near IC3) Digital Attenuator
- R137 power = 35mA^2*100 = 0.12W
- F clk max = 30MHz
- (near C2) -6dBm
- -6.9dBm
- Amplifier
  23 dB gain and 13 dBm P1dB
- (near IC17) With about -3dBm out of the DDS, 0.5 dB insertion loss from the Balun, 0.5 dB from the lowpass, 1.5 dB from the attenuator, we need a 1dB T-pad to attenuate that before the ERA-3+ with 23 dB gain and P1dB of 13 dBm at our frequencies.
- SPDT switch
- I=12mA
- (near T3) This circuit generates RF switch control voltage: between 2.5 and 5.8V
- (near IC9) Single voltage supply for HMC1118
- We need more than 10uF to keep TL431 stable
- IP3:40 dBm typical at 20 MHz,
  39 dBm typical at 0.5GHz
  Supply Voltage, 3 to 5V
  Gain, 22.4 dB typ. at 0.5 GHz
- Project/Equipment
- Document
- Designer
- Drawn by
- Check.by
- Copyright WUT ISE 2018.
  This documentation describes Open Hardware and is licensed under the CERN OHL v.1.1. You may redistribute and modify this documentation under the terms of the CERN OHL v.1.1. (http://ohwr.org/CERNOHL). This documentation is distributed WITHOUT ANY EXPRESS OR IMPLIED WARRANTY, INCLUDING OF MERCHANTABILITY, SATISFACTORY QUALITY AND FITNESS FOR A PARTICULAR PURPOSE. Please see the CERN OHL v.1.1 for applicable conditions.
- Contact
- File
- Last Mod.
- Print Date
- Sheet
- Size
- A3
- of
- Rev
- (in symbol FIL_MINI-CIRCUITS_LFCN-320) IN; OUT
- (in symbol HMC542BLP4E) 0.5dB; LE; 1dB; S_IN; S_OUT; 2dB; CONTROL INTERFACE; 4dB; CLK; 8dB; RST; 16dB
- (in symbol HMC1118LP3DE) 50
- (in symbol R0402_1K5_1%_0.0625W_100PPM) 1%
- (in symbol R0402_4K7_1%_0.0625W_100PPM) 1%
- (in symbol R0402_6K2_1%_0.0625W_100PPM) 1%
- (in symbol R0402_7K5_1%_0.0625W_100PPM) 1%
- (in symbol R0402_24K_1%_0.0625W_100PPM) 1%
- (in symbol R0402_100R_1%_0.0625W_100PPM) 1%
- (in symbol R1206_100R_1%_0.5W_100PPM_VISHAY_CRCW-HP e3) 1%
- (in symbol RF_PAT1220-C-9DB-T5) 9dB

### Library data of the parts
C1-C4 C13 C25 C26 C28 C34 = CC0402_2.2UF_6.3V_10%_X5R: Non-polarised capacitor; Part Description: SMD Multilayer Chip Ceramic Capacitor; Manufacturer: GENERIC; Manufacturer1 Part Number: C1005X5R0J225K050BC; Voltage: 6.3V; TC: X5R; Tolerance: ±10%; Part Number: CC0402_2.2UF_6.3V_10%_X5R; Component Kind: Standard; Component Type: Standard; Pin Count: 2; Value: 2.2uF; Status: Preferred; Manufacturer Part Number: CC0402_2.2UF_6.3V_10%_X5R; Case: 0402; Mounted: Yes; Socket: No; SMD: Yes; Sense: No; Manufacturer1 Example: TDK; Manufacturer1 ComponentHeight: 0.55mm; HelpURL: \\cern.ch\dfs\Applications\Altium\Datasheets\CC0402_X5R_TDK_C.pdf; Author: CERN DEM JMW; CreateDate: 22.09.2015; LatestRevisionDate: 22.09.2015
C5-C7 C9 C10 C29 C32 C33 C37 C71 = CC0402_100PF_50V_5%_C0G: Non-polarised capacitor; Part Description: SMD Multilayer Chip Ceramic Capacitor; Manufacturer: GENERIC; Manufacturer1 Part Number: C0402C101J5GACTU; Voltage: 50V; TC: C0G/NP0; Tolerance: ±5%; Part Number: CC0402_100PF_50V_5%_C0G; Component Kind: Standard; Component Type: Standard; Pin Count: 2; Value: 100pF; Status: Preferred; Manufacturer Part Number: CC0402_100PF_50V_5%_C0G; Case: 0402; Mounted: Yes; Socket: No; SMD: Yes; Sense: No; Manufacturer1 Example: KEMET; Manufacturer1 ComponentHeight: 0.55mm; HelpURL: \\cern.ch\dfs\Applications\Altium\Datasheets\CC0805_C0G_KEMET_(Commercial Grade).pdf; Author: CERN DEM JLC; CreateDate: 2007-12-03; LatestRevisionDate: 2015-04-22
C8 C11 C21 C35 C36 C38 C40 C72 C80 = CC0603_10UF_16V_20%_X5R: Non-polarised capacitor; Part Description: SMD Multilayer Chip Ceramic Capacitor; Manufacturer: GENERIC; Manufacturer1 Part Number: GRM188R61C106MA73D; Voltage: 16V; TC: X5R; Tolerance: ±20%; Part Number: CC0603_10UF_16V_20%_X5R; Component Kind: Standard; Component Type: Standard; Pin Count: 2; Value: 10uF; Status: None; Manufacturer Part Number: CC0603_10UF_16V_20%_X5R; Case: 0603; Mounted: Yes; Socket: No; SMD: Yes; Sense: No; Manufacturer1 Example: MURATA; Manufacturer1 ComponentHeight: 0.8mm; HelpURL: \\cern.ch\dfs\Applications\Altium\Datasheets\CC0603_X5R_MURATA_GRM.pdf; Author: CERN DEM MR; CreateDate: 2016-03-02; LatestRevisionDate: 2016-03-02
C12 = CC0805_1UF_35V_20%_X7R: Non-polarised capacitor; Part Description: SMD Multilayer Chip Ceramic Capacitor; Manufacturer: GENERIC; Manufacturer1 Part Number: GMK212B7105MG-T; Voltage: 35V; TC: X7R; Tolerance: ±20%; Part Number: CC0805_1UF_35V_20%_X7R; Component Kind: Standard; Component Type: Standard; Pin Count: 2; Value: 1uF; Status: Not Recommended; Manufacturer Part Number: CC0805_1UF_35V_20%_X7R; Case: 0805; Mounted: Yes; Socket: No; SMD: Yes; Sense: No; Manufacturer1 Example: TAIYO YUDEN; Manufacturer1 ComponentHeight: 1.35mm; HelpURL: \\cern.ch\dfs\Applications\Altium\Datasheets\CC0805_X7R_TAIYO-YUDEN_HIGH-VALUE.pdf; Author: CERN DEM JLC; CreateDate: 2011-06-22; LatestRevisionDate: 2011-06-22
C14-C20 = CC0402_10NF_16V_10%_X7R: Non-polarised capacitor; Part Description: SMD Multilayer Chip Ceramic Capacitor; Manufacturer: GENERIC; Manufacturer1 Part Number: 223878715636; Voltage: 16V; TC: X7R; Tolerance: ±10%; Part Number: CC0402_10NF_16V_10%_X7R; Component Kind: Standard; Component Type: Standard; Pin Count: 2; Value: 10nF; Status: Not Recommended; Manufacturer Part Number: CC0402_10NF_16V_10%_X7R; Case: 0402; Mounted: Yes; Socket: No; SMD: Yes; Sense: No; Manufacturer1 Example: PHYCOMP; Manufacturer1 ComponentHeight: 0.55mm; HelpURL: \\cern.ch\dfs\Applications\Altium\Datasheets\CC0402_X7R_PHYCOMP.pdf; Author: CERN DEM JLC; CreateDate: 2007-12-03; LatestRevisionDate: 2007-12-03
C23 C31 = CC0402_1NF_50V_10%_X7R: Non-polarised capacitor; Part Description: SMD Multilayer Chip Ceramic Capacitor; Manufacturer: GENERIC; Manufacturer1 Part Number: 223858715623; Voltage: 50V; TC: X7R; Tolerance: ±10%; Part Number: CC0402_1NF_50V_10%_X7R; Component Kind: Standard; Component Type: Standard; Pin Count: 2; Value: 1nF; Status: Not Recommended; Manufacturer Part Number: CC0402_1NF_50V_10%_X7R; Case: 0402; Mounted: Yes; Socket: No; SMD: Yes; Sense: No; Manufacturer1 Example: PHYCOMP; Manufacturer1 ComponentHeight: 0.55mm; HelpURL: \\cern.ch\dfs\Applications\Altium\Datasheets\CC0402_X7R_PHYCOMP.pdf; Author: CERN DEM JLC
  C23: CreateDate: 2007-12-03; LatestRevisionDate: 2007-12-03
  C31: CreateDate: 03.12.2007; LatestRevisionDate: 03.12.2007
C27 = CC0402_100NF_16V_10%_X5R: as C42 on sheet Quad_DDS; Part Number: CC0402_100NF_16V_10%_X5R; Component Kind: Standard; Component Type: Standard; Pin Count: 2; Value: 100nF; Status: None; Manufacturer Part Number: CC0402_100NF_16V_10%_X5R; Case: 0402; Mounted: Yes; Socket: No; SMD: Yes; Sense: No; Manufacturer1 Example: MURATA; Manufacturer1 ComponentHeight: 0.55mm; HelpURL: \\cern.ch\dfs\Applications\Altium\Datasheets\CC0402_X5R_MURATA_GRM.pdf; Author: CERN DEM JLC; CreateDate: 10.12.2013; LatestRevisionDate: 10.12.2013
C30 = CC0805_10UF_16V_10%_X5R: Non-polarised capacitor; Part Description: SMD Multilayer Chip Ceramic Capacitor; Manufacturer: GENERIC; Manufacturer1 Part Number: C0805C106K4PAC; Voltage: 16V; TC: X5R; Tolerance: ±10%; Part Number: CC0805_10UF_16V_10%_X5R; Component Kind: Standard; Component Type: Standard; Pin Count: 2; Value: 10uF; Status: Preferred; Manufacturer Part Number: CC0805_10UF_16V_10%_X5R; Case: 0805; Mounted: Yes; Socket: No; SMD: Yes; Sense: No; Manufacturer1 Example: KEMET; Manufacturer1 ComponentHeight: 1.4mm; HelpURL: \\cern.ch\dfs\Applications\Altium\Datasheets\CC1206_X5R_KEMET.pdf; Author: CERN DEM JLC; CreateDate: 03.12.2007; LatestRevisionDate: 03.12.2007
C39 = CC0402_1UF_16V_10%_X5R: as C101 on sheet Quad_DDS; Part Number: CC0402_1UF_16V_10%_X5R; Component Kind: Standard; Component Type: Standard; Pin Count: 2; Value: 1uF; Status: Preferred; Manufacturer Part Number: CC0402_1UF_16V_10%_X5R; Case: 0402; Mounted: Yes; Socket: No; SMD: Yes; Sense: No; Manufacturer1 Example: TDK; Manufacturer1 ComponentHeight: 0.55mm; HelpURL: \\cern.ch\dfs\Applications\Altium\Datasheets\CC0402_X5R_TDK_C.pdf; Author: CERN DEM JLC; CreateDate: 25.10.2012; LatestRevisionDate: 25.10.2012
FL2 = FIL_MINI-CIRCUITS_LFCN-320: 50 Ohm DC to 320MHz Low Pass Filter; Part Number: FIL_MINI-CIRCUITS_LFCN-160; Part Description: 50 Ohm Low Pass Filter; Manufacturer Part Number: LFCN-160; Component Kind: Standard; Component Type: Standard; Pin Count: 2; Value: DC to 160MHz; Status: None; Manufacturer: MINI-CIRCUITS; Mounted: Yes; Socket: No; SMD: Yes; Sense: No; ComponentHeight: 0.94mm; HelpURL: \\cern.ch\dfs\Applications\Altium\Datasheets\FIL_MINI-CIRCUITS_LFCN-3000+.pdf; Author: CERN DEM JLC; CreateDate: 2013-12-09; LatestRevisionDate: 2013-12-09
IC1 = PHA-1H+: Monolithic Amplifier; Part Description: 0.05-6GHz Surface Mount Monolithic Amplifier; Manufacturer: MINI-CIRCUITS; PressFit: No; Bonding: No; Part Number: PHA-13LN+; Component Kind: Standard; Component Type: Standard; Device: PHA-13LN+; PackageDescription: MINI-CIRCUITS DF782 Case, 1.50mm pitch; 4 pin, 2.44mm W X 4.49mm L; Manufacturer Part Number: PHA-13LN+; Pin Count: 4; Mounted: Yes; Socket: No; SMD: Yes; Sense: No; ComponentHeight: 1.6mm; Author: CERN DEM MR; HelpURL: \\cern.ch\dfs\Applications\Altium\Datasheets\PHA-1H+.pdf; CreateDate: 04.10.2017; LatestRevisionDate: 04.10.2017
IC3 = HMC542BLP4E: 0.5dB LSB GaAs MMIC 6-bit Digital Serial Control Attenuator, DC - 4GHz; Part Description: 0.5dB LSB GaAs MMIC 6-bit Digital Serial Control Attenuator, DC to 4GHz; Manufacturer: HITTITE MICROWAVE CORP; PressFit: No; Bonding: No; Part Number: HMC542BLP4E; Component Kind: Standard; Component Type: Standard; Device: HMC542BLP4E; PackageDescription: QFN, 0.50mm Pitch, Square; 24 Pin, 4.00mm L X 4.00mm W X 1.00mm H Body (w/thermal Tab 2.95 X 2.95mm), IPC Medium Density; Manufacturer Part Number: HMC542BLP4E; Pin Count: 25; Case: QFN24; Mounted: Yes; Socket: No; SMD: Yes; Sense: No; ComponentHeight: 1mm; Author: CERN DEM JMW; HelpURL: \\cern.ch\dfs\Applications\Altium\Datasheets\HMC542BLP4E.pdf; CreateDate: 2016-08-17; LatestRevisionDate: 2016-08-17
IC4 IC6 = HMC1118LP3DE: High Isolation, Silicon SPDT, Non-Reflective Switch, 9 kHz to 13.0 GHz; Manufacturer: ANALOG DEVICES; PressFit: No; Bonding: No; Part Number: HMC1118LP3DE; Component Kind: Standard; Component Type: Standard; Device: HMC1118LP3DE; PackageDescription: QFN, 0.50mm Pitch, Square; 16 Pin, 3.00mm L X 3.00mm W X 0.95mm H Body (w/Thermal Tab 1.90 X 1.90mm),  IPC Medium Density; Part Description: High Isolation, Silicon SPDT, Non-Reflective Switch, 9 kHz to 13.0 GHz; Manufacturer Part Number: HMC1118LP3DE; Pin Count: 17; Case: QFN16; Mounted: Yes; Socket: No; SMD: Yes; Sense: No; ComponentHeight: 0.95mm; Author: CERN DEM MR; HelpURL: \\cern.ch\dfs\Applications\Altium\Datasheets\HMC1118LP3DE.pdf; CreateDate: 17.04.2019; LatestRevisionDate: 17.04.2019
IC5 = RF_ERA-3SM+: DC-3GHz Monolithic Amplifier; Manufacturer: MINI-CIRCUITS; PressFit: No; Bonding: No; Part Number: ERA-3SM+; Component Kind: Standard; Component Type: Standard; Device: ERA-3SM+; PackageDescription: MINI-CIRCUITS WW107 Case, Body 2.16mm Diameter X 1.52mm H; Part Description: DC-3GHz Monolithic Amplifier; Manufacturer Part Number: ERA-3SM+; Pin Count: 4; Mounted: Yes; Socket: No; SMD: Yes; Sense: No; ComponentHeight: 1.52mm; Author: GK; HelpURL: \\cern.ch\dfs\Applications\Altium\Datasheets\ERA-4XSM+.pdf; CreateDate: 11.08.2016; LatestRevisionDate: 11.08.2016
IC8 IC9 = TL431ACDBZT: Precision Reference 1=Cathode 2=Adj 3=Anode; Part Description: Vref (2.5V) To 36V 1% Precision Programmable Reference; Manufacturer: TEXAS INSTRUMENTS; PressFit: No; Bonding: No; Part Number: TL431ACDBZT; Component Kind: Standard; Component Type: Standard; Device: TL431ACDBZT; PackageDescription: SOT, 0.95mm, Pitch; 3 pin,1.30mm W X 2.92mm L X 1.12mm H Body, IPC Medium Density; Manufacturer Part Number: TL431ACDBZT; Pin Count: 3; Case: SOT23; Mounted: Yes; Socket: No; SMD: Yes; Sense: No; ComponentHeight: 1.12mm; HelpURL: \\cern.ch\dfs\Applications\Altium\Datasheets\TL431ACDBZT.pdf; Author: CERN DEM JLC; CreateDate: 28.02.2011; LatestRevisionDate: 28.02.2011
IC17 = RF_PAT1220-C-9DB-T5: DC to 10GHz, 100mw, 50 Ohm, 9dB, Precision chip attenuator; Part Description: DC to 10GHz, 100mw, 50 Ohm, 9dB, Precision Chip 3dB Attenuator; Manufacturer: SUSUMU; PressFit: No; Sense Comment: Solder Paste Deposition Limitation; Bonding: No; Part Number: PAT1220-C-1DB-T5; Component Kind: Standard; Component Type: Standard; Device: PAT1220-C-1DB-T5; Footprint: SUSUMU_PAT1220-C-1DB-T5; PackageDescription: SUSUMU PAT1220, 4 Pin Attenuator, Sise 0402, L 1.00 x W 0.5 H 0.39mm; Status: Recommended; Manufacturer Part Number: PAT1220-C-1DB-T5; Pin Count: 4; Case: 0402; Mounted: Yes; Socket: No; SMD: Yes; Sense: Yes; ComponentHeight: 0.39mm; Author: GK; HelpURL: \\cern.ch\dfs\Applications\Altium\Datasheets\PAT0510S-C-9DB-T10.pdf; CreateDate: 09.03.2017; LatestRevisionDate: 02.05.2017
L8 L16 = IND_10UH_10%_MURATA_LQH32CN100K33L: Inductor With Core; Part Description: Chip Inductor (Chip Coil) for Choke Wire Wound Type; Manufacturer: MURATA; Power: 450mA; Resistance: 0.3R; Tolerance: ±10%; Part Number: IND_10UH_10%_MURATA_LQH32CN100K33L; Component Kind: Standard; Component Type: Standard; Pin Count: 2; Value: 10uH; Status: None; Manufacturer Part Number: LQH32CN100K33L; Mounted: Yes; Socket: No; SMD: Yes; Sense: No; ComponentHeight: 2.2mm; HelpURL: \\cern.ch\dfs\Applications\Altium\Datasheets\IND_MURATA_LQH32CN_33.pdf; Author: CERN DEM JLC; CreateDate: 06.04.2009; LatestRevisionDate: 04.07.2018
L11-L15 L17 = IND0603_TDK_MPZ1608R391A: Inductor; Part Description: SMT Chip Bead for Power Line; Manufacturer: TDK; Power: 1.2A; Resistance: 0.12R; Tolerance: ±25%; Part Number: IND0603_TDK_MPZ1608R391A; Component Kind: Standard; Component Type: Standard; Pin Count: 2; Value: 390R@100MHz; Status: None; Manufacturer Part Number: MPZ1608R391A; Case: 0603; Mounted: Yes; Socket: No; SMD: Yes; Sense: No; ComponentHeight: 0.95mm; HelpURL: \\cern.ch\dfs\Applications\Altium\Datasheets\IND0603_TDK_MPZ1608.pdf; Author: CERN DEM JLC; CreateDate: 2009-12-02; LatestRevisionDate: 2009-12-02
L18 = IND0603_4.7NH_2%_MURATA_LQW18AN4N7G8Z: Inductor With Core; Part Description: Wirw Wond RF Inductor For Automotive; Manufacturer: MURATA; Power: 1.5A; Resistance: 0R054; Tolerance: ±2%; Part Number: IND0603_4.7NH_2%_MURATA_LQW18AN4N7G8Z; Component Kind: Standard; Component Type: Standard; Pin Count: 2; Value: 4.7nH; Status: None; Manufacturer Part Number: LQW18AN4N7G8Z; Case: 0603; Mounted: Yes; Socket: No; SMD: Yes; Sense: No; ComponentHeight: 1mm; HelpURL: \\cern.ch\dfs\Applications\Altium\Datasheets\IND_MURATA_LQW18AN4N7G8Z.pdf; Author: CERN DEM BC; CreateDate: 26.08.2019; LatestRevisionDate: 26.08.2019
R1 R6 = R0402_7K5_1%_0.0625W_100PPM: Resistor - 1%; Part Description: General Purpose Thick Film Chip Resistor; Manufacturer: GENERIC; Manufacturer1 Part Number: 232270677502L; TC: ±100ppm/°C; PressFit: No; Part Number: R0402_7K5_1%_0.0625W_100PPM; Component Kind: Standard; Component Type: Standard; Pin Count: 2; Value: 7k5; Status: Not Recommended; Power: 0.0625W; Tolerance: ±1%; Manufacturer Part Number: R0402_7K5_1%_0.0625W_100PPM; Case: 0402; Mounted: Yes; Sense: No; Socket: No; SMD: Yes; Manufacturer1 Example: YAGEO PHYCOMP; Manufacturer1 ComponentHeight: 0.4mm; HelpURL: \\cern.ch\dfs\Applications\Altium\Datasheets\R0402_Phycomp_RC0402.pdf; Author: CERN DEM JLC; CreateDate: 03.12.2007; LatestRevisionDate: 17.10.2012
R2 R138 R? = R0402_0R_JUMPER: Resistor; Part Description: 1A (0.05R Max DC Resistance) Zero Ohm Jumper; Manufacturer: GENERIC; Manufacturer1 Part Number: 232270591001L; Part Number: R0402_0R_JUMPER; Component Kind: Standard; Component Type: Standard; Pin Count: 2; Value: 0; Status: Not recommended; Manufacturer Part Number: R0402_0R_JUMPER; Case: 0402; Mounted: Yes; Sense: No; Socket: No; SMD: Yes; Manufacturer1 Example: YAGEO PHYCOMP; Manufacturer1 ComponentHeight: 0.4mm; HelpURL: \\cern.ch\dfs\Applications\Altium\Datasheets\R0402_Phycomp_RC0402.pdf; Author: CERN DEM JLC; CreateDate: 2007-12-03; LatestRevisionDate: 2012-10-17
R3 R4 = R0402_NO-VALUE: Resistor; Part Description: Reserved Footprint For a 0402 (1005) Chip Resistor; Mounted: No; Part Number: R0402_NO-VALUE; Component Kind: Standard; Component Type: Standard; Pin Count: 2; Value: Undefined; Status: None; Manufacturer: Undefined; Manufacturer Part Number: R0402_NO-VALUE; Case: 0402; Sense: No; Socket: No; SMD: Yes; Manufacturer1 Example: Undefined; Manufacturer1 Part Number: Undefined; Manufacturer1 ComponentHeight: Undefined; HelpURL: Undefined; Author: CERN DEM JLC; CreateDate: 03.12.2007; LatestRevisionDate: 13.03.2008
R7 = R0402_6K2_1%_0.0625W_100PPM: Resistor - 1%; Part Description: General Purpose Thick Film Chip Resistor; Manufacturer: GENERIC; Manufacturer1 Part Number: 232270676202L; TC: ±100ppm/°C; PressFit: No; Part Number: R0402_6K2_1%_0.0625W_100PPM; Component Kind: Standard; Component Type: Standard; Pin Count: 2; Value: 6k2; Status: Not Recommended; Power: 0.0625W; Tolerance: ±1%; Manufacturer Part Number: R0402_6K2_1%_0.0625W_100PPM; Case: 0402; Mounted: Yes; Sense: No; Socket: No; SMD: Yes; Manufacturer1 Example: YAGEO PHYCOMP; Manufacturer1 ComponentHeight: 0.4mm; HelpURL: \\cern.ch\dfs\Applications\Altium\Datasheets\R0402_Phycomp_RC0402.pdf; Author: CERN DEM JLC; CreateDate: 03.12.2007; LatestRevisionDate: 17.10.2012
R9 = R0402_24K_1%_0.0625W_100PPM: Resistor - 1%; Part Description: General Purpose Thick Film Chip Resistor; Manufacturer: GENERIC; Manufacturer1 Part Number: 232270672403L; TC: ±100ppm/°C; PressFit: No; Part Number: R0402_24K_1%_0.0625W_100PPM; Component Kind: Standard; Component Type: Standard; Pin Count: 2; Value: 24k; Status: Not Recommended; Power: 0.0625W; Tolerance: ±1%; Manufacturer Part Number: R0402_24K_1%_0.0625W_100PPM; Case: 0402; Mounted: Yes; Sense: No; Socket: No; SMD: Yes; Manufacturer1 Example: YAGEO PHYCOMP; Manufacturer1 ComponentHeight: 0.4mm; HelpURL: \\cern.ch\dfs\Applications\Altium\Datasheets\R0402_Phycomp_RC0402.pdf; Author: CERN DEM JLC; CreateDate: 03.12.2007; LatestRevisionDate: 17.10.2012
R10 = R0402_1K5_1%_0.0625W_100PPM: Resistor - 1%; Part Description: General Purpose Thick Film Chip Resistor; Manufacturer: GENERIC; Manufacturer1 Part Number: 232270671502L; TC: ±100ppm/°C; PressFit: No; Part Number: R0402_1K5_1%_0.0625W_100PPM; Component Kind: Standard; Component Type: Standard; Pin Count: 2; Value: 1k5; Status: Not Recommended; Power: 0.0625W; Tolerance: ±1%; Manufacturer Part Number: R0402_1K5_1%_0.0625W_100PPM; Case: 0402; Mounted: Yes; Sense: No; Socket: No; SMD: Yes; Manufacturer1 Example: YAGEO PHYCOMP; Manufacturer1 ComponentHeight: 0.4mm; HelpURL: \\cern.ch\dfs\Applications\Altium\Datasheets\R0402_Phycomp_RC0402.pdf; Author: CERN DEM JLC; CreateDate: 03.12.2007; LatestRevisionDate: 17.10.2012
R11 R20 = R0402_4K7_1%_0.0625W_100PPM: Resistor - 1%; Part Description: General Purpose Thick Film Chip Resistor; Manufacturer: GENERIC; Manufacturer1 Part Number: 232270674702L; TC: ±100ppm/°C; Part Number: R0402_4K7_1%_0.0625W_100PPM; Component Kind: Standard; Component Type: Standard; Pin Count: 2; Value: 4k7; Status: Not recommended; Power: 0.0625W; Tolerance: ±1%; Manufacturer Part Number: R0402_4K7_1%_0.0625W_100PPM; Case: 0402; Mounted: Yes; Sense: No; Socket: No; SMD: Yes; Manufacturer1 Example: YAGEO PHYCOMP; Manufacturer1 ComponentHeight: 0.4mm; HelpURL: \\cern.ch\dfs\Applications\Altium\Datasheets\R0402_Phycomp_RC0402.pdf; Author: CERN DEM JLC; CreateDate: 2007-12-03; LatestRevisionDate: 2012-10-17
R16 = R0402_100R_1%_0.0625W_100PPM: as R27 on sheet Quad_DDS; Part Number: R0402_100R_1%_0.0625W_100PPM; Component Kind: Standard; Component Type: Standard; Pin Count: 2; Value: 100; Status: Not Recommended; Power: 0.0625W; Tolerance: ±1%; Manufacturer Part Number: R0402_100R_1%_0.0625W_100PPM; Case: 0402; Mounted: Yes; Sense: No; Socket: No; SMD: Yes; Manufacturer1 Example: YAGEO PHYCOMP; Manufacturer1 ComponentHeight: 0.4mm; HelpURL: \\cern.ch\dfs\Applications\Altium\Datasheets\R0402_Phycomp_RC0402.pdf; Author: CERN DEM JLC; CreateDate: 03.12.2007; LatestRevisionDate: 17.10.2012
R137 = R1206_100R_1%_0.5W_100PPM_VISHAY_CRCW-HP e3: Resistor - 1%; Part Description: Pulse Proof, High Power Thick Film Chip Resistor; Manufacturer: VISHAY DRALORIC; Manufacturer Part Number: CRCW1206100RFKEAHP; Power: 0.5W; TC: ±100ppm/°C; Voltage: 200V; PressFit: No; Part Number: R1206_100R_1%_0.5W_100PPM_VISHAY_CRCW-HP e3; Component Kind: Standard; Component Type: Standard; Pin Count: 2; Value: 100; Status: None; Tolerance: ±1%; Case: 1206; Mounted: Yes; Sense: No; Socket: No; SMD: Yes; HelpURL: \\cern.ch\dfs\Applications\Altium\Datasheets\R1206_VISHAY_CRCW-HP e3.pdf; Author: CERN DEM JLC; CreateDate: 19.11.2013; LatestRevisionDate: 19.11.2013; ComponentHeight: 0.65mm
T2 T3 = BSS138LT1G: N-CHANNEL MOSFET WITH DIODE; Part Description: 50V 200mA N-Channel Enhancement Mode Field-Effect Transistor; Manufacturer: ON SEMICONDUCTOR; PressFit: No; Bonding: No; Part Number: BSS138LT1G; Component Kind: Standard; Component Type: Standard; Device: BSS138LT1G; PackageDescription: SOT23 3-Leads, Pitch 0.95mm - Body 1.4x3mm, IPC Medium Density; Manufacturer Part Number: BSS138LT1G; Pin Count: 3; Case: SOT23-3; Mounted: Yes; Socket: No; SMD: Yes; Sense: No; ComponentHeight: 1.11mm; HelpURL: \\cern.ch\dfs\Applications\Altium\Datasheets\BSS138LT1G.pdf; Author: CERN DEM JLC; CreateDate: 23.03.2009; LatestRevisionDate: 23.03.2009
T10 = Si2315BDS-T1-E3: P-CHANNEL MOSFET WITH DIODE; Part Description: -12V -3A P-Channel STripFET® II Power MOSFET; Manufacturer: VISHAY SILICONIX; PressFit: No; Bonding: No; Part Number: Si2315BDS-T1-E3; Component Kind: Standard; Component Type: Standard; Device: Si2315BDS-T1-E3; PackageDescription: SOT, 0.95mm, pitch; 3 pin,1.30mm W X 2.92mm L X 1.12mm H body, IPC Medium Density; Manufacturer Part Number: Si2315BDS-T1-E3; Pin Count: 3; Case: SOT23-3; Mounted: Yes; Socket: No; SMD: Yes; Sense: No; ComponentHeight: 1.12mm; HelpURL: \\cern.ch\dfs\Applications\Altium\Datasheets\Si2315BDS-T1-E3.pdf; Author: CERN DEM JLC; CreateDate: 02.05.2011; LatestRevisionDate: 02.05.2011